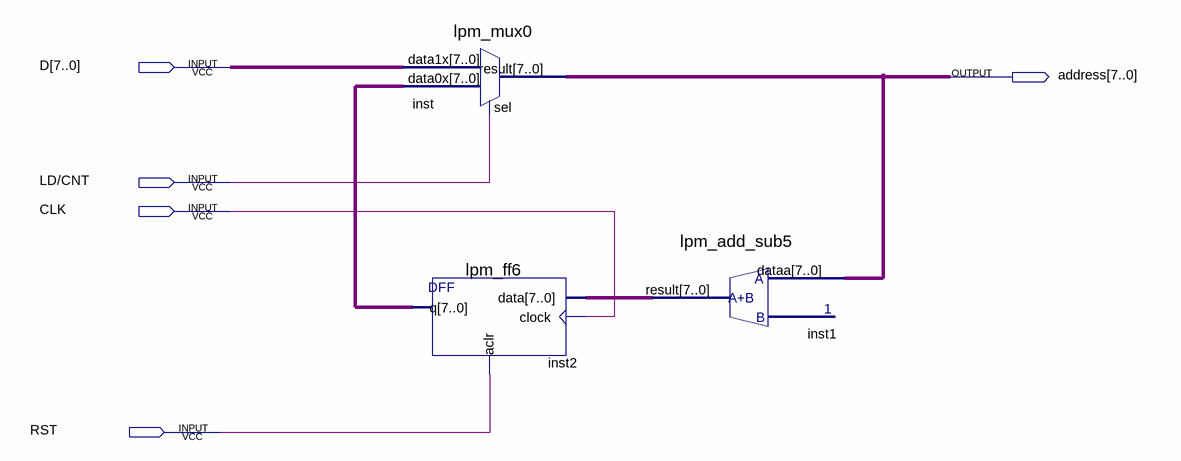
[diagram p0: schematic sheet]
// Quartus schematic PC.bdf as structural Verilog: 3 symbols, 5 pins
module PC (
  input  [7:0] D,
  input  \LD/CNT ,
  input  CLK,
  input  RST,
  output [7:0] address
);

  wire [7:0] inst1_result, inst2_q;

  lpm_mux0 inst (.data1x(D), .data0x(inst2_q), .sel(\LD/CNT ), .result(address));
  lpm_ff6 inst2 (.data(inst1_result), .clock(CLK), .aclr(RST), .q(inst2_q));
  lpm_add_sub5 inst1 (.dataa(address), .result(inst1_result));
endmodule
